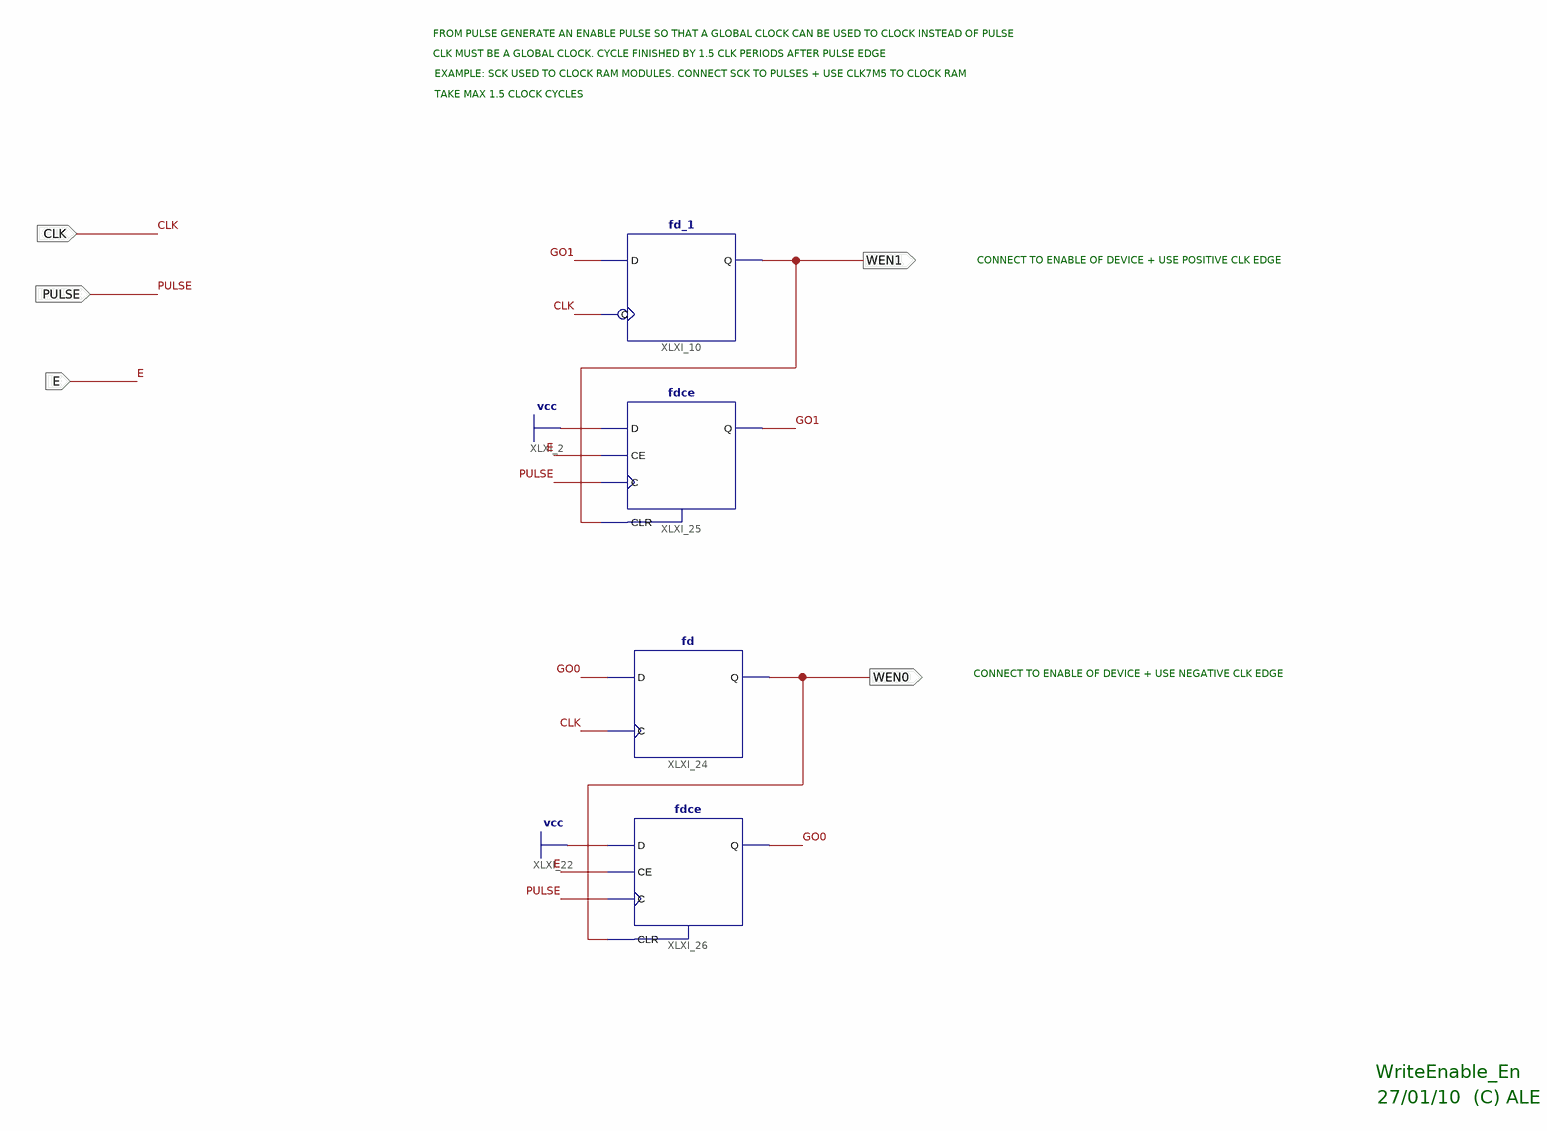
[diagram p0: schematic sheet 1]
// Xilinx ISE schematic WriteEnable_En.sch (spartan3e) as structural Verilog: 4 symbols, 5 ports
module WriteEnable_En (
  input  CLK,
  input  PULSE,
  input  E,
  output WEN1,
  output WEN0
);

  wire GO0, GO1;

  fd_1 XLXI_10 (.C(CLK), .D(GO1), .Q(WEN1));
  fd XLXI_24 (.C(CLK), .D(GO0), .Q(WEN0));
  fdce XLXI_25 (.C(PULSE), .CE(E), .CLR(WEN1), .D(1'b1), .Q(GO1));
  fdce XLXI_26 (.C(PULSE), .CE(E), .CLR(WEN0), .D(1'b1), .Q(GO0));

  // Notes on the sheet:
  //   FROM PULSE GENERATE AN ENABLE PULSE SO THAT A GLOBAL CLOCK CAN BE USED TO CLOCK INSTEAD OF PULSE
  //   CLK MUST BE A GLOBAL CLOCK. CYCLE FINISHED BY 1.5 CLK PERIODS AFTER PULSE EDGE
  //   EXAMPLE: SCK USED TO CLOCK RAM MODULES. CONNECT SCK TO PULSES + USE CLK7M5 TO CLOCK RAM
  //   TAKE MAX 1.5 CLOCK CYCLES
  //   CONNECT TO ENABLE OF DEVICE + USE POSITIVE CLK EDGE
  //   CONNECT TO ENABLE OF DEVICE + USE NEGATIVE CLK EDGE
  //   WriteEnable_En
  //   27/01/10  (C) ALE
endmodule
